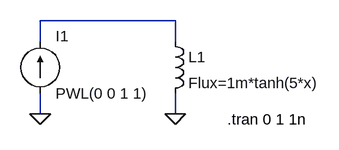
[diagram p0: schematic ArbitraryInductance.asc]
ArbitraryInductance.asc, the LTspice schematic file:
Version 4
SHEET 1 880 680
WIRE 64 224 64 192
WIRE 64 336 64 304
WIRE 272 192 64 192
WIRE 272 224 272 192
WIRE 272 336 272 304
FLAG 64 336 0
FLAG 272 336 0
SYMBOL current 64 304 M180
WINDOW 0 24 88 Left 0
WINDOW 3 24 0 Left 0
SYMATTR InstName I1
SYMATTR Value PWL(0 0 1 1)
SYMBOL ind 256 208 R0
SYMATTR InstName L1
SYMATTR Value Flux=1m*tanh(5*x)
TEXT 352 344 Left 0 !.tran 0 1 1n

The netlist it stands for:
* ArbitraryInductance.asc
I1 0 N001 PWL(0 0 1 1)
L1 N001 0 Flux=1m*tanh(5*x)
.tran 0 1 1n
.backanno
.end